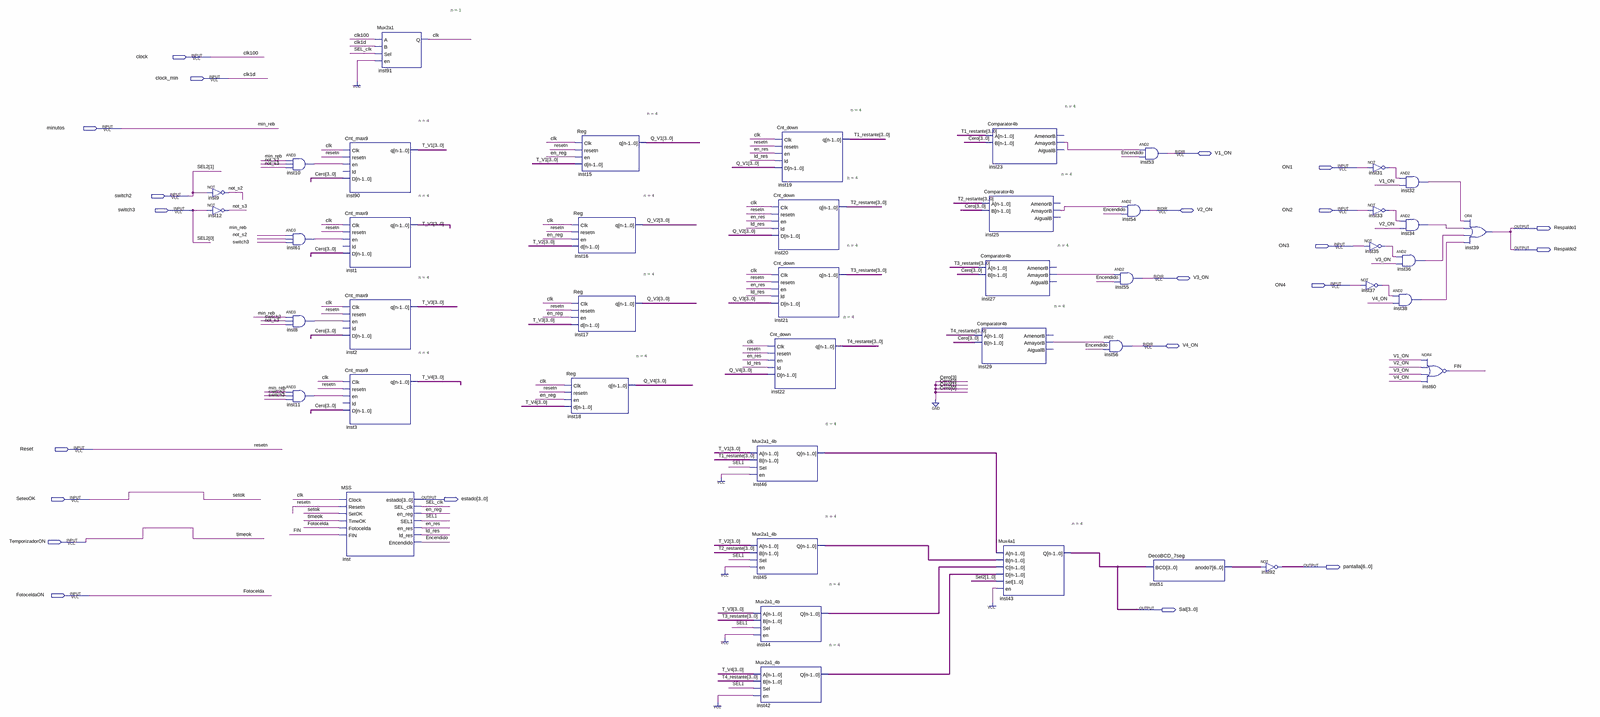
[diagram p0: schematic sheet, whole]
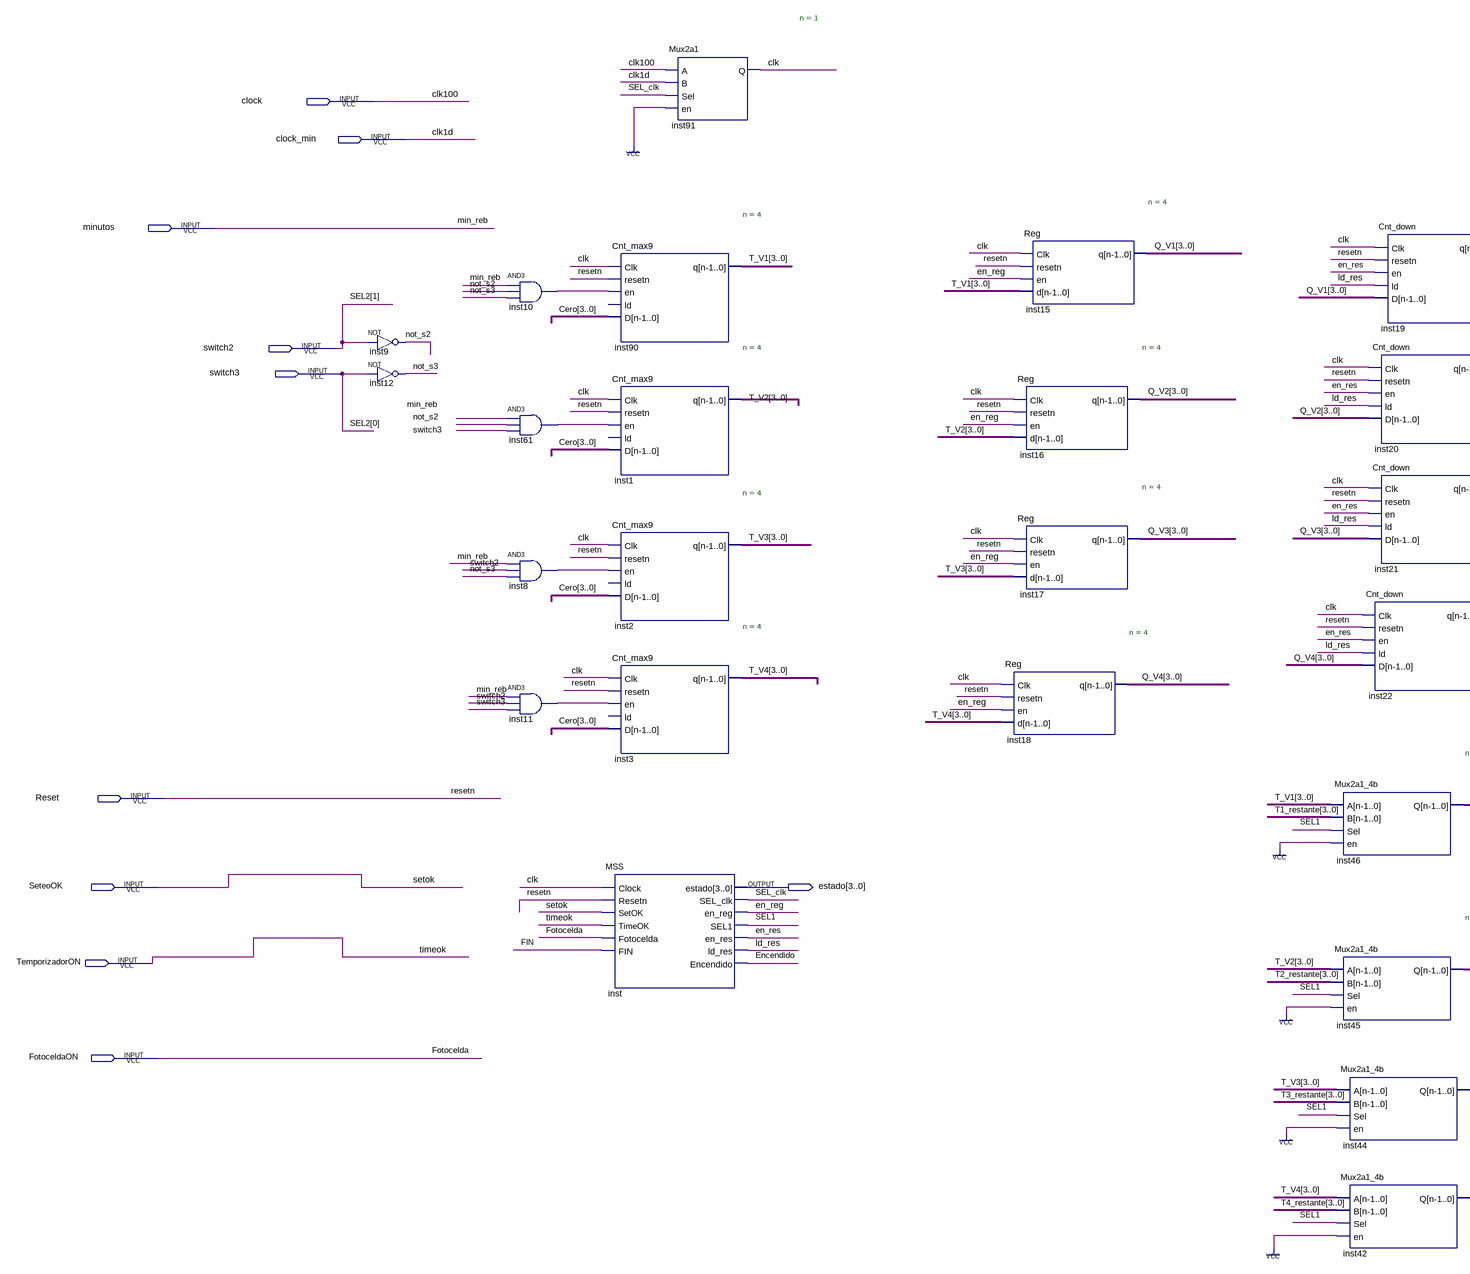
[diagram p1: schematic sheet, left part]
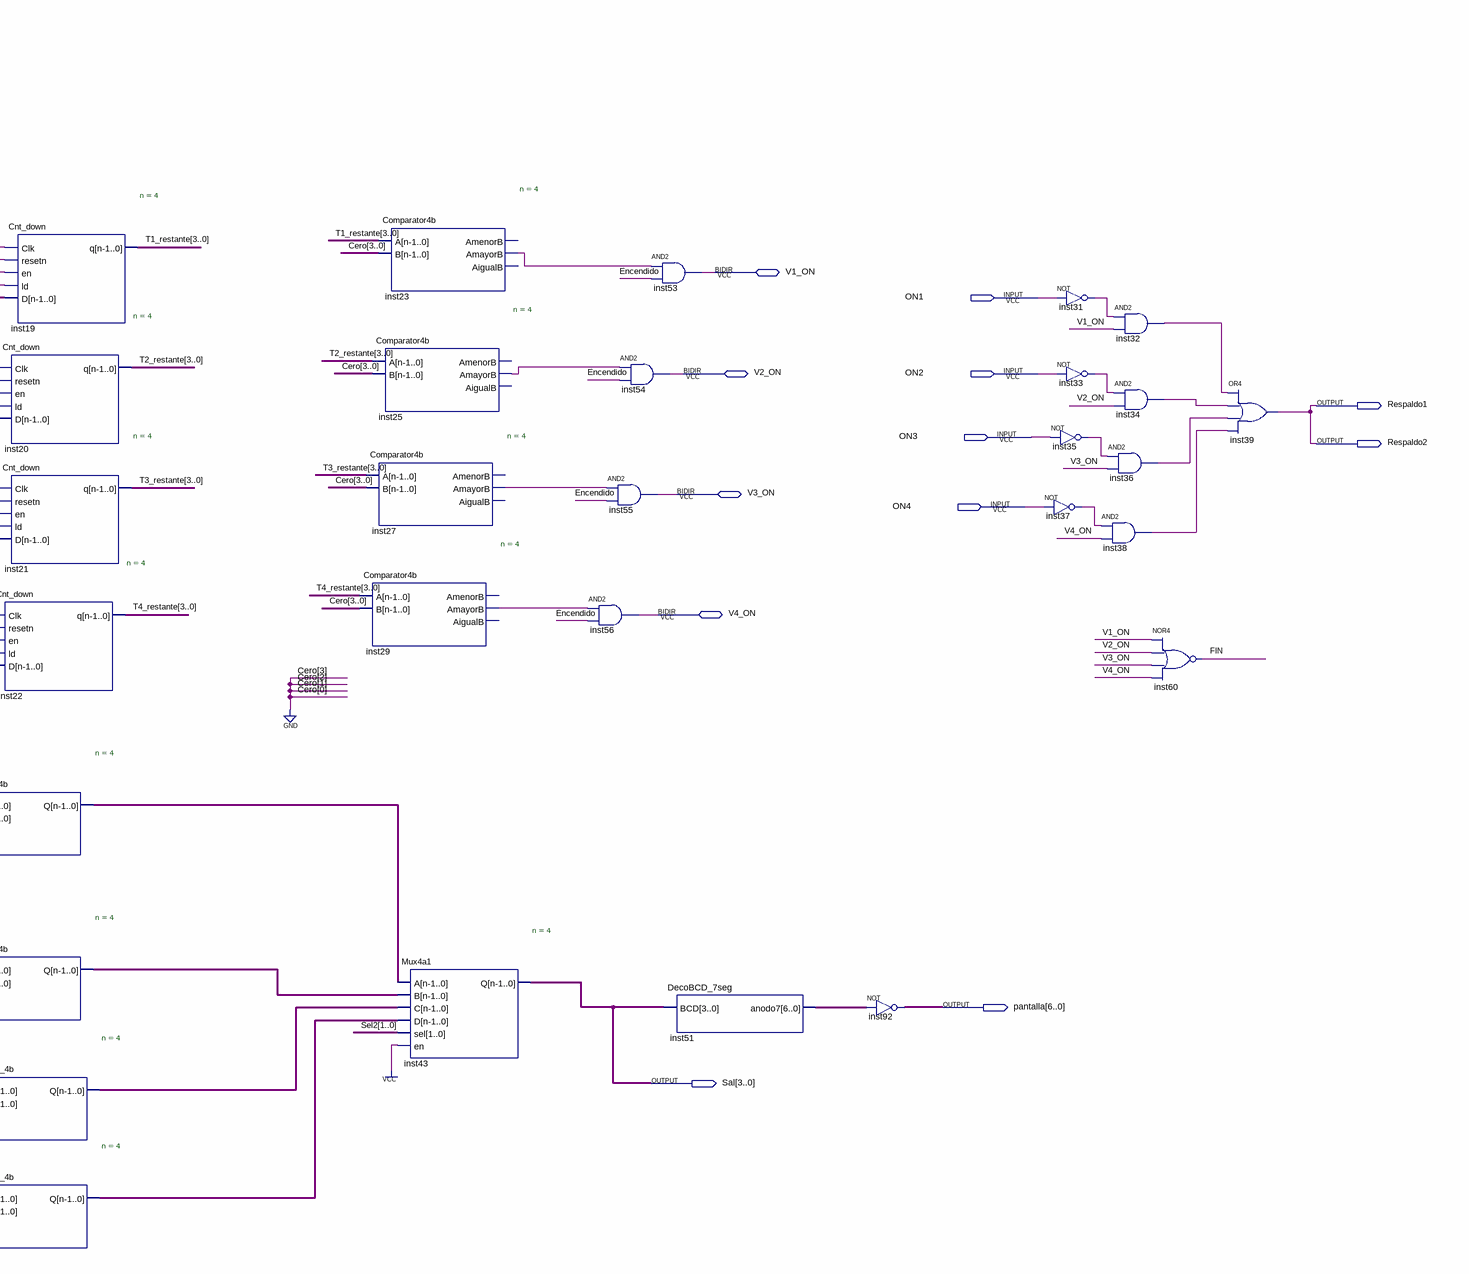
[diagram p2: schematic sheet, right part]
// Quartus schematic Proyecto.bdf as structural Verilog: 45 symbols, 22 pins
module Proyecto (
  input  clock,
  input  clock_min,
  input  minutos,
  input  ON1,
  input  switch2,
  input  switch3,
  input  ON2,
  input  ON3,
  input  ON4,
  input  Reset,
  input  SeteoOK,
  input  TemporizadorON,
  input  FotoceldaON,
  inout  V1_ON,
  inout  V2_ON,
  inout  V3_ON,
  inout  V4_ON,
  output Respaldo1,
  output Respaldo2,
  output [3:0] estado,
  output [6:0] pantalla,
  output [3:0] Sal
);

  wire clk, en_reg, en_res, Encendido, FIN, inst8_out, inst10_out, inst11_out, inst23_amayorb,
       inst25_amayorb, inst27_amayorb, inst29_amayorb, inst31_out, inst32_out, inst33_out, inst34_out,
       inst35_out, inst36_out, inst37_out, inst38_out, inst61_out, ld_res, not_s2, not_s3, SEL1, SEL_clk;
  wire [3:0] inst42_q, inst44_q, inst45_q, inst46_q, Q_V1, Q_V2, Q_V3, Q_V4, T1_restante, T2_restante,
       T3_restante, T4_restante, T_V1, T_V2, T_V3, T_V4;
  wire [6:0] inst51_anodo7;

  not inst9 (not_s2, switch2);
  not inst12 (not_s3, switch3);
  and inst10 (inst10_out, minutos, not_s2, not_s3);
  and inst61 (inst61_out, minutos, not_s2, switch3);
  and inst8 (inst8_out, minutos, switch2, not_s3);
  and inst11 (inst11_out, minutos, switch2, switch3);
  Cnt_max9 #(.n(4)) inst90 (.Clk(clk), .resetn(Reset), .en(inst10_out), .D(4'b0000), .q(T_V1));  // open: ld
  Cnt_max9 #(.n(4)) inst1 (.Clk(clk), .resetn(Reset), .en(inst61_out), .D(4'b0000), .q(T_V2));  // open: ld
  Cnt_max9 #(.n(4)) inst2 (.Clk(clk), .resetn(Reset), .en(inst8_out), .D(4'b0000), .q(T_V3));  // open: ld
  Cnt_max9 #(.n(4)) inst3 (.Clk(clk), .resetn(Reset), .en(inst11_out), .D(4'b0000), .q(T_V4));  // open: ld
  MSS inst (
    .Clock(clk), .Resetn(Reset), .SetOK(SeteoOK), .TimeOK(TemporizadorON), .Fotocelda(FotoceldaON),
    .FIN(FIN), .estado(estado), .SEL_clk(SEL_clk), .en_reg(en_reg), .SEL1(SEL1), .en_res(en_res),
    .ld_res(ld_res), .Encendido(Encendido));
  Mux2a1 #(.n(1)) inst91 (.A(clock), .B(clock_min), .Sel(SEL_clk), .en(1'b1), .Q(clk));
  Reg #(.n(4)) inst18 (.Clk(clk), .resetn(Reset), .en(en_reg), .d(T_V4), .q(Q_V4));
  Reg #(.n(4)) inst15 (.Clk(clk), .resetn(Reset), .en(en_reg), .d(T_V1), .q(Q_V1));
  Reg #(.n(4)) inst16 (.Clk(clk), .resetn(Reset), .en(en_reg), .d(T_V2), .q(Q_V2));
  Reg #(.n(4)) inst17 (.Clk(clk), .resetn(Reset), .en(en_reg), .d(T_V3), .q(Q_V3));
  Mux2a1_4b #(.n(4)) inst46 (.A(T_V1), .B(T1_restante), .Sel(SEL1), .en(1'b1), .Q(inst46_q));
  Mux2a1_4b #(.n(4)) inst45 (.A(T_V2), .B(T2_restante), .Sel(SEL1), .en(1'b1), .Q(inst45_q));
  Mux2a1_4b #(.n(4)) inst44 (.A(T_V3), .B(T3_restante), .Sel(SEL1), .en(1'b1), .Q(inst44_q));
  Mux2a1_4b #(.n(4)) inst42 (.A(T_V4), .B(T4_restante), .Sel(SEL1), .en(1'b1), .Q(inst42_q));
  Cnt_down #(.n(4)) inst19 (.Clk(clk), .resetn(Reset), .en(en_res), .ld(ld_res), .D(Q_V1), .q(T1_restante));
  Cnt_down #(.n(4)) inst20 (.Clk(clk), .resetn(Reset), .en(en_res), .ld(ld_res), .D(Q_V2), .q(T2_restante));
  Cnt_down #(.n(4)) inst21 (.Clk(clk), .resetn(Reset), .en(en_res), .ld(ld_res), .D(Q_V3), .q(T3_restante));
  Cnt_down #(.n(4)) inst22 (.Clk(clk), .resetn(Reset), .en(en_res), .ld(ld_res), .D(Q_V4), .q(T4_restante));
  Comparator4b #(.n(4)) inst23 (.A(T1_restante), .B(4'b0000), .AmayorB(inst23_amayorb));  // open: AmenorB, AigualB
  Comparator4b #(.n(4)) inst25 (.A(T2_restante), .B(4'b0000), .AmayorB(inst25_amayorb));  // open: AmenorB, AigualB
  Comparator4b #(.n(4)) inst27 (.A(T3_restante), .B(4'b0000), .AmayorB(inst27_amayorb));  // open: AmenorB, AigualB
  Comparator4b #(.n(4)) inst29 (.A(T4_restante), .B(4'b0000), .AmayorB(inst29_amayorb));  // open: AmenorB, AigualB
  Mux4a1 #(.n(4)) inst43 (
    .A(inst46_q), .B(inst45_q), .C(inst44_q), .D(inst42_q), .sel({switch2, switch3}), .en(1'b1), .Q(Sal));
  and inst56 (V4_ON, inst29_amayorb, Encendido);
  and inst54 (V2_ON, inst25_amayorb, Encendido);
  and inst55 (V3_ON, inst27_amayorb, Encendido);
  and inst53 (V1_ON, inst23_amayorb, Encendido);
  DecoBCD_7seg inst51 (.BCD(Sal), .anodo7(inst51_anodo7));
  assign pantalla = ~inst51_anodo7;  // NOT inst92, 7 bits wide
  not inst35 (inst35_out, ON3);
  not inst37 (inst37_out, ON4);
  not inst31 (inst31_out, ON1);
  not inst33 (inst33_out, ON2);
  and inst38 (inst38_out, inst37_out, V4_ON);
  and inst32 (inst32_out, inst31_out, V1_ON);
  and inst34 (inst34_out, inst33_out, V2_ON);
  and inst36 (inst36_out, inst35_out, V3_ON);
  nor inst60 (FIN, V1_ON, V2_ON, V3_ON, V4_ON);
  or inst39 (Respaldo1, inst32_out, inst34_out, inst36_out, inst38_out);

  assign Respaldo2 = Respaldo1;

  // Other names for the same wires on the sheet: clk1d = clock_min; clk100 = clock; Fotocelda = FotoceldaON;
  //   min_reb = minutos; resetn = Reset; Sel2[1:0] = {switch2, switch3}; setok = SeteoOK; timeok = TemporizadorON
endmodule
